# Altium schematic sheet UNO Shield_2021-10-31.schdoc
size 291 x 206 mm
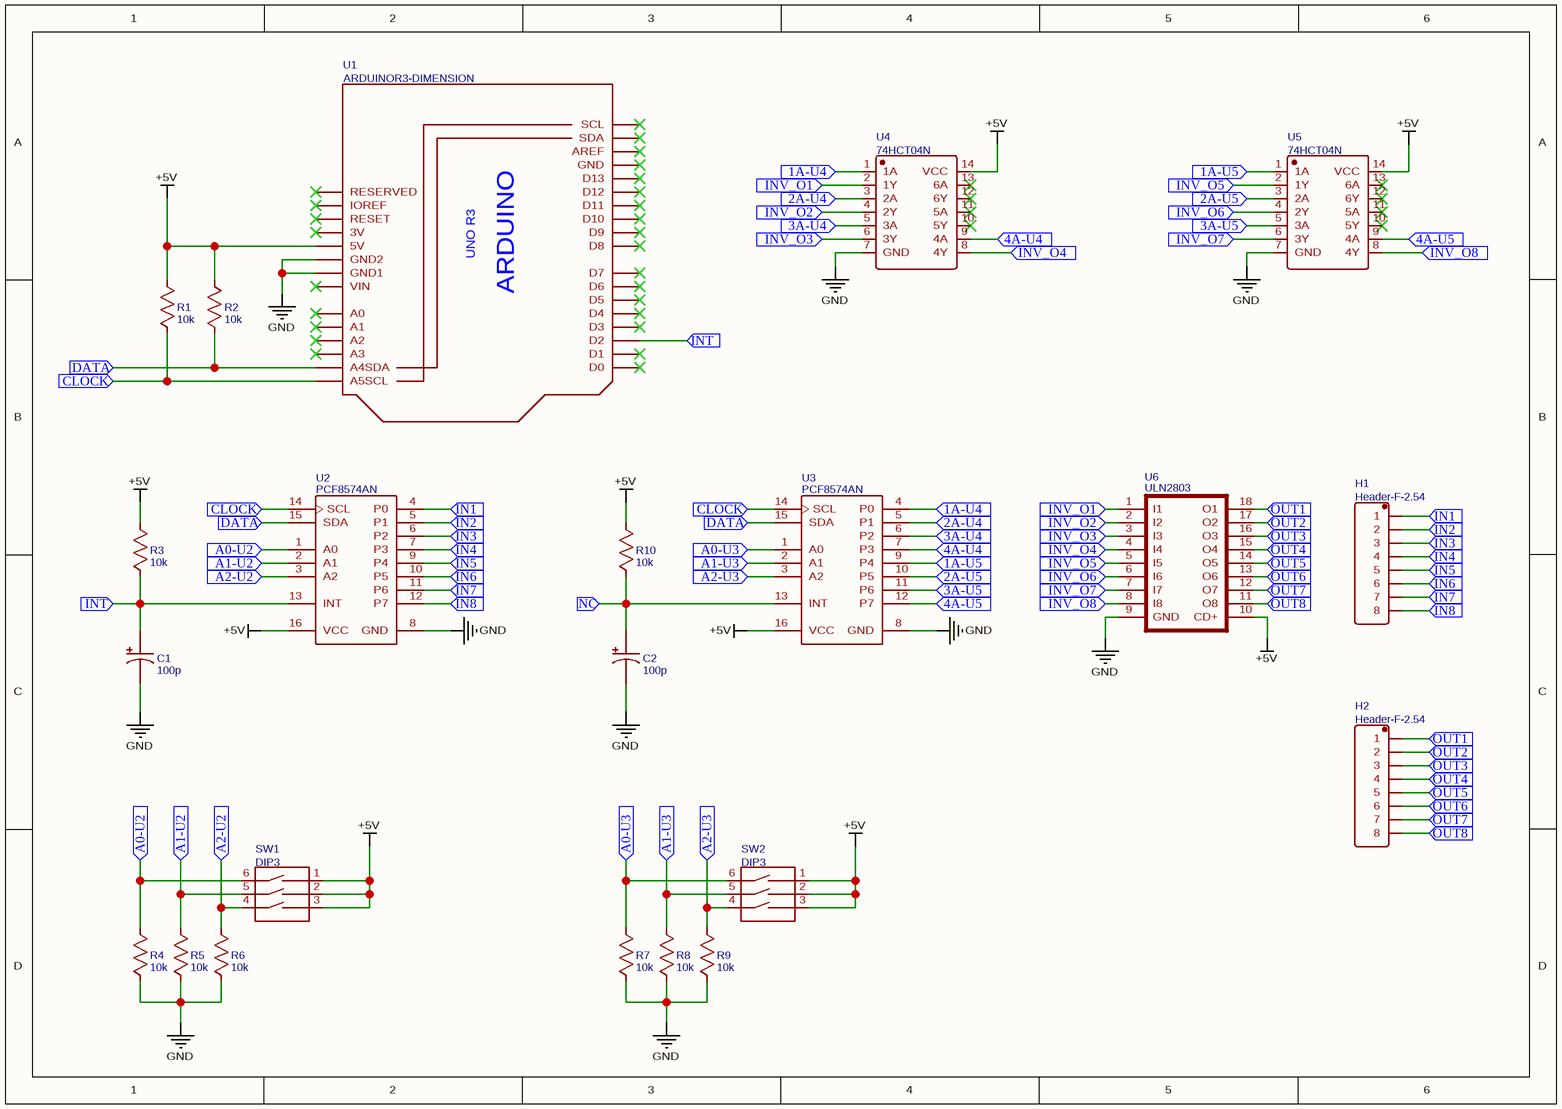
[diagram p0: UNO Shield_2021-10-31.schdoc]

## Parts
C1  100p  [CASE-C_6032]
C2  100p  [CASE-C_6032]
H1  Header-F-2.54  [210S-1X8P]
H2  Header-F-2.54  [210S-1X8P]
R1  10k  [1206R]
R2  10k  [1206R]
R3  10k  [1206R]
R4  10k  [1206R]
R5  10k  [1206R]
R6  10k  [1206R]
R7  10k  [1206R]
R8  10k  [1206R]
R9  10k  [1206R]
R10  10k  [1206R]
SW1  DIP3  [VDG/S-03HG-R]
SW2  DIP3  [VDG/S-03HG-R]
U1  ARDUINOR3-DIMENSION  [ARDUINOR3]
U2  PCF8574AN  [DIP16]
U3  PCF8574AN  [DIP16]
U4  74HCT04N  [DIP14]
U5  74HCT04N  [DIP14]
U6  ULN2803  [DIL18]

## Ports
1A-U4 (in), 1A-U5 (in), 2A-U4 (in), 2A-U5 (in), 3A-U4 (in), 3A-U5 (in), 4A-U4 (in), 4A-U5 (in), A0-U2 (in), A0-U3 (in), A1-U2 (in), A1-U3 (in), A2-U2 (in), A2-U3 (in), CLOCK (in), DATA (in), IN1 (in), IN2 (in), IN3 (in), IN4 (in), IN5 (in), IN6 (in), IN7 (in), IN8 (in), INT (in), INV_O1 (in), INV_O2 (in), INV_O3 (in), INV_O4 (in), INV_O5 (in), INV_O6 (in), INV_O7 (in), INV_O8 (in), NC (in), OUT1 (in), OUT2 (in), OUT3 (in), OUT4 (in), OUT5 (in), OUT6 (in), OUT7 (in), OUT8 (in)

## Nets
+5V: R1.2 R2.2 R3.2 R10.2 SW1.1 SW1.2 SW1.3 SW2.1 SW2.2 SW2.3 U1.5V U2.16(VCC) U3.16(VCC) U4.14(VCC) U5.14(VCC) U6.10(CD+)
GND: C1.2 C2.2 R4.1 R5.1 R6.1 R7.1 R8.1 R9.1 U1.GND1 U1.GND2 U2.8(GND) U3.8(GND) U4.7(GND) U5.7(GND) U6.9(GND)
1A-U4: U3.4(P0) U4.1(1A) ; port 1A-U4
1A-U5: U3.9(P4) U5.1(1A) ; port 1A-U5
2A-U4: U3.5(P1) U4.3(2A) ; port 2A-U4
2A-U5: U3.10(P5) U5.3(2A) ; port 2A-U5
3A-U4: U3.6(P2) U4.5(3A) ; port 3A-U4
3A-U5: U3.11(P6) U5.5(3A) ; port 3A-U5
4A-U4: U3.7(P3) U4.9(4A) ; port 4A-U4
4A-U5: U3.12(P7) U5.9(4A) ; port 4A-U5
A0-U2: R4.2 SW1.6 U2.1(A0) ; port A0-U2
A0-U3: R7.2 SW2.6 U3.1(A0) ; port A0-U3
A1-U2: R5.2 SW1.5 U2.2(A1) ; port A1-U2
A1-U3: R8.2 SW2.5 U3.2(A1) ; port A1-U3
A2-U2: R6.2 SW1.4 U2.3(A2) ; port A2-U2
A2-U3: R9.2 SW2.4 U3.3(A2) ; port A2-U3
CLOCK: R1.1 U1.A5(A5SCL) U2.14(SCL) U3.14(SCL) ; port CLOCK
DATA: R2.1 U1.A4(A4SDA) U2.15(SDA) U3.15(SDA) ; port DATA
IN1: H1.1 U2.4(P0) ; port IN1
IN2: H1.2 U2.5(P1) ; port IN2
IN3: H1.3 U2.6(P2) ; port IN3
IN4: H1.4 U2.7(P3) ; port IN4
IN5: H1.5 U2.9(P4) ; port IN5
IN6: H1.6 U2.10(P5) ; port IN6
IN7: H1.7 U2.11(P6) ; port IN7
IN8: H1.8 U2.12(P7) ; port IN8
INT: C1.1 R3.1 U1.D2 U2.13(INT) ; port INT
INV_O1: U4.2(1Y) U6.1(I1) ; port INV_O1
INV_O2: U4.4(2Y) U6.2(I2) ; port INV_O2
INV_O3: U4.6(3Y) U6.3(I3) ; port INV_O3
INV_O4: U4.8(4Y) U6.4(I4) ; port INV_O4
INV_O5: U5.2(1Y) U6.5(I5) ; port INV_O5
INV_O6: U5.4(2Y) U6.6(I6) ; port INV_O6
INV_O7: U5.6(3Y) U6.7(I7) ; port INV_O7
INV_O8: U5.8(4Y) U6.8(I8) ; port INV_O8
NC: C2.1 R10.1 U3.13(INT) ; port NC
OUT1: H2.1 U6.18(O1) ; port OUT1
OUT2: H2.2 U6.17(O2) ; port OUT2
OUT3: H2.3 U6.16(O3) ; port OUT3
OUT4: H2.4 U6.15(O4) ; port OUT4
OUT5: H2.5 U6.14(O5) ; port OUT5
OUT6: H2.6 U6.13(O6) ; port OUT6
OUT7: H2.7 U6.12(O7) ; port OUT7
OUT8: H2.8 U6.11(O8) ; port OUT8

Not connected (* = marked no-connect by the designer): U1 3V* A0* A1* A2* A3* AREF* D0* D1* D3* D4* D5* D6* D7* D8* D9* D10* D11* D12* D13* GND* IOREF* RESERVED* RESET* SCL* SDA* VIN*; U4 10(5Y)* 11(5A)* 12(6Y)* 13(6A)*; U5 10(5Y)* 11(5A)* 12(6Y)* 13(6A)*

## Notes on the sheet
- (in symbol ARDUINOR3-DIMENSION) UNO R3; ARDUINO

## Library data of the parts
C1 C2 = 100p: nameAlias: Value(F); spicePre: C; spiceSymbolName: Cap_Tantalum(TH)_TAN-S2.5_US
H1 H2 = Header-F-2.54: BOM_Manufacturer: Ckmtw; BOM_Manufacturer Part: 210S-1*8P L=11.6MMGold-plated black; Contributor: LCSC; BOM_Supplier: LCSC; BOM_Supplier Part: C124381; spicePre: H
R1-R10 = 10k: nameAlias: Value(Ω); spicePre: R; spiceSymbolName: Res_AXIAL-0.4(1/4W)_US
SW1 SW2 = DIP3: BOM_Manufacturer: ReliaPro; BOM_Supplier: LCSC; BOM_Manufacturer Part: VDG/S-03HG-R; image: //image.lceda.cn/szlcsc/C52648.jpg; BOM_Supplier Part: C52648; spicePre: D
U1 = ARDUINOR3-DIMENSION: description: This is a new object for the new Arduino R3 - with extra pins that you may want to use (such as IOref, and duplicated A4A5; Contributor: Adafruit; spicePre: U
U2 U3 = PCF8574AN: description: Remote 8-Bit IO Expander for I2C-Bus, 2.5 to 6 V, -40 to 85 degC, 16-pin PDIP (N), Pb-Free (RoHS); spicePre: U
U6 = ULN2803: Contributor: DangerousPrototype; spicePre: U
U4 U5 = 74HCT04N: spicePre: X